# EAGLE design flashtest (EAGLE 9.3.0)
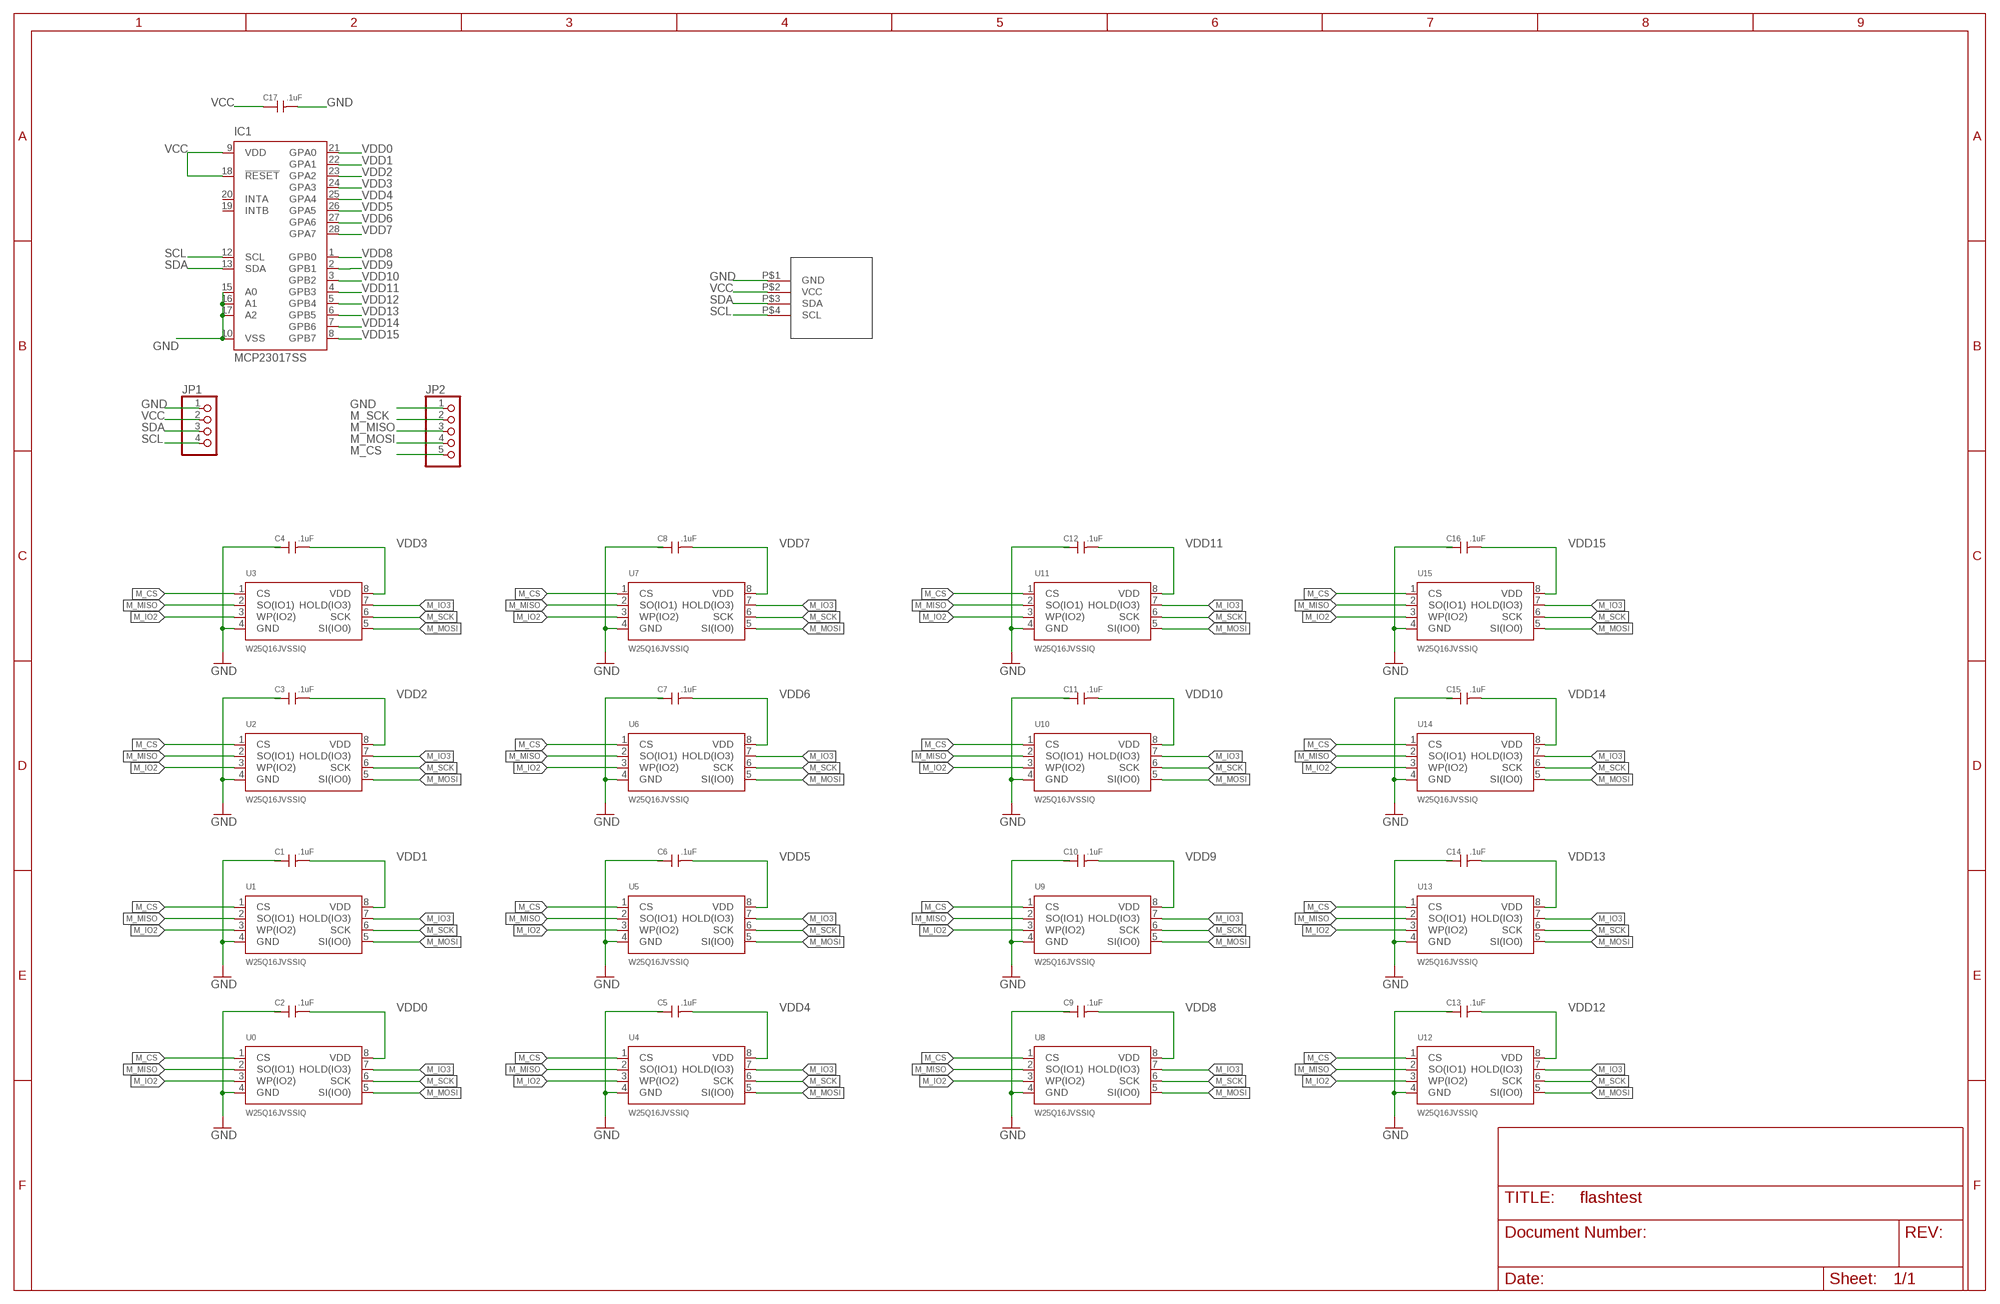
[diagram p0: schematic, sheet 1]

## Parts
C1  .1uF  006-C35*40  [0603@1]
C2  .1uF  006-C35*40  [0603@1]
C3  .1uF  006-C35*40  [0603@1]
C4  .1uF  006-C35*40  [0603@1]
C5  .1uF  006-C35*40  [0603@1]
C6  .1uF  006-C35*40  [0603@1]
C7  .1uF  006-C35*40  [0603@1]
C8  .1uF  006-C35*40  [0603@1]
C9  .1uF  006-C35*40  [0603@1]
C10  .1uF  006-C35*40  [0603@1]
C11  .1uF  006-C35*40  [0603@1]
C12  .1uF  006-C35*40  [0603@1]
C13  .1uF  006-C35*40  [0603@1]
C14  .1uF  006-C35*40  [0603@1]
C15  .1uF  006-C35*40  [0603@1]
C16  .1uF  006-C35*40  [0603@1]
C17  .1uF  006-C35*40  [0603@1]
IC1  MCP23017SS  [SSOP28]
JP1  PINHD-1X4  [1X04]
JP2  PINHD-1X5  [1X05]
U0  W25Q16JVSSIQ  FLASH_QSPI  [SOIC-8]
U1  W25Q16JVSSIQ  FLASH_QSPI  [SOIC-8]
U2  W25Q16JVSSIQ  FLASH_QSPI  [SOIC-8]
U3  W25Q16JVSSIQ  FLASH_QSPI  [SOIC-8]
U4  W25Q16JVSSIQ  FLASH_QSPI  [SOIC-8]
U5  W25Q16JVSSIQ  FLASH_QSPI  [SOIC-8]
U6  W25Q16JVSSIQ  FLASH_QSPI  [SOIC-8]
U7  W25Q16JVSSIQ  FLASH_QSPI  [SOIC-8]
U8  W25Q16JVSSIQ  FLASH_QSPI  [SOIC-8]
U9  W25Q16JVSSIQ  FLASH_QSPI  [SOIC-8]
U10  W25Q16JVSSIQ  FLASH_QSPI  [SOIC-8]
U11  W25Q16JVSSIQ  FLASH_QSPI  [SOIC-8]
U12  W25Q16JVSSIQ  FLASH_QSPI  [SOIC-8]
U13  W25Q16JVSSIQ  FLASH_QSPI  [SOIC-8]
U14  W25Q16JVSSIQ  FLASH_QSPI  [SOIC-8]
U15  W25Q16JVSSIQ  FLASH_QSPI  [SOIC-8]
U$1  I2C  [I2C]

## Nets
GND: C1.1 C2.1 C3.1 C4.1 C5.1 C6.1 C7.1 C8.1 C9.1 C10.1 C11.1 C12.1 C13.1 C14.1 C15.1 C16.1 C17.2 IC1.10(VSS) IC1.15(A0) IC1.16(A1) IC1.17(A2) JP1.1 JP2.1 U0.4(GND) U1.4(GND) U2.4(GND) U3.4(GND) U4.4(GND) U5.4(GND) U6.4(GND) U7.4(GND) U8.4(GND) U9.4(GND) U10.4(GND) U11.4(GND) U12.4(GND) U13.4(GND) U14.4(GND) U15.4(GND) U$1.P$1(GND)
M_CS: JP2.5 U0.1(CS) U1.1(CS) U2.1(CS) U3.1(CS) U4.1(CS) U5.1(CS) U6.1(CS) U7.1(CS) U8.1(CS) U9.1(CS) U10.1(CS) U11.1(CS) U12.1(CS) U13.1(CS) U14.1(CS) U15.1(CS)
M_IO2: U0.3(WP(IO2)) U1.3(WP(IO2)) U2.3(WP(IO2)) U3.3(WP(IO2)) U4.3(WP(IO2)) U5.3(WP(IO2)) U6.3(WP(IO2)) U7.3(WP(IO2)) U8.3(WP(IO2)) U9.3(WP(IO2)) U10.3(WP(IO2)) U11.3(WP(IO2)) U12.3(WP(IO2)) U13.3(WP(IO2)) U14.3(WP(IO2)) U15.3(WP(IO2))
M_IO3: U0.7(HOLD(IO3)) U1.7(HOLD(IO3)) U2.7(HOLD(IO3)) U3.7(HOLD(IO3)) U4.7(HOLD(IO3)) U5.7(HOLD(IO3)) U6.7(HOLD(IO3)) U7.7(HOLD(IO3)) U8.7(HOLD(IO3)) U9.7(HOLD(IO3)) U10.7(HOLD(IO3)) U11.7(HOLD(IO3)) U12.7(HOLD(IO3)) U13.7(HOLD(IO3)) U14.7(HOLD(IO3)) U15.7(HOLD(IO3))
M_MISO: JP2.3 U0.2(SO(IO1)) U1.2(SO(IO1)) U2.2(SO(IO1)) U3.2(SO(IO1)) U4.2(SO(IO1)) U5.2(SO(IO1)) U6.2(SO(IO1)) U7.2(SO(IO1)) U8.2(SO(IO1)) U9.2(SO(IO1)) U10.2(SO(IO1)) U11.2(SO(IO1)) U12.2(SO(IO1)) U13.2(SO(IO1)) U14.2(SO(IO1)) U15.2(SO(IO1))
M_MOSI: JP2.4 U0.5(SI(IO0)) U1.5(SI(IO0)) U2.5(SI(IO0)) U3.5(SI(IO0)) U4.5(SI(IO0)) U5.5(SI(IO0)) U6.5(SI(IO0)) U7.5(SI(IO0)) U8.5(SI(IO0)) U9.5(SI(IO0)) U10.5(SI(IO0)) U11.5(SI(IO0)) U12.5(SI(IO0)) U13.5(SI(IO0)) U14.5(SI(IO0)) U15.5(SI(IO0))
M_SCK: JP2.2 U0.6(SCK) U1.6(SCK) U2.6(SCK) U3.6(SCK) U4.6(SCK) U5.6(SCK) U6.6(SCK) U7.6(SCK) U8.6(SCK) U9.6(SCK) U10.6(SCK) U11.6(SCK) U12.6(SCK) U13.6(SCK) U14.6(SCK) U15.6(SCK)
SCL: IC1.12(SCL) JP1.4 U$1.P$4(SCL)
SDA: IC1.13(SDA) JP1.3 U$1.P$3(SDA)
VCC: C17.1 IC1.9(VDD) IC1.18(!RESET) JP1.2 U$1.P$2(VCC)
VDD0: C2.2 IC1.21(GPA0) U0.8(VDD)
VDD1: C1.2 IC1.22(GPA1) U1.8(VDD)
VDD2: C3.2 IC1.23(GPA2) U2.8(VDD)
VDD3: C4.2 IC1.24(GPA3) U3.8(VDD)
VDD4: C5.2 IC1.25(GPA4) U4.8(VDD)
VDD5: C6.2 IC1.26(GPA5) U5.8(VDD)
VDD6: C7.2 IC1.27(GPA6) U6.8(VDD)
VDD7: C8.2 IC1.28(GPA7) U7.8(VDD)
VDD8: C9.2 IC1.1(GPB0) U8.8(VDD)
VDD9: C10.2 IC1.2(GPB1) U9.8(VDD)
VDD10: C11.2 IC1.3(GPB2) U10.8(VDD)
VDD11: C12.2 IC1.4(GPB3) U11.8(VDD)
VDD12: C13.2 IC1.5(GPB4) U12.8(VDD)
VDD13: C14.2 IC1.6(GPB5) U13.8(VDD)
VDD14: C15.2 IC1.7(GPB6) U14.8(VDD)
VDD15: C16.2 IC1.8(GPB7) U15.8(VDD)
Unconnected: IC1.19(INTB) IC1.20(INTA)

## Library data of the parts
C1-C17 = Discrete:006-C*: Ceramic Capacitors
IC1 = microchip:MCP23017: http://ww1.microchip.com/downloads/en/DeviceDoc/21952a.pdf Source: http://ww1.microchip.com/downloads/en/DeviceDoc/21952a.pdf; MF: MICROCHIP; MPN: MCP23017-E/SS; OC_FARNELL: 1467674; OC_NEWARK: 31K2960
JP1 = pinhead:PINHD-1X4: PIN HEADER
JP2 = pinhead:PINHD-1X5: PIN HEADER
U0 U1-U15 = TravisT_MEM:FLASH_QSPI
U$1 = i2c:I2C

## Board
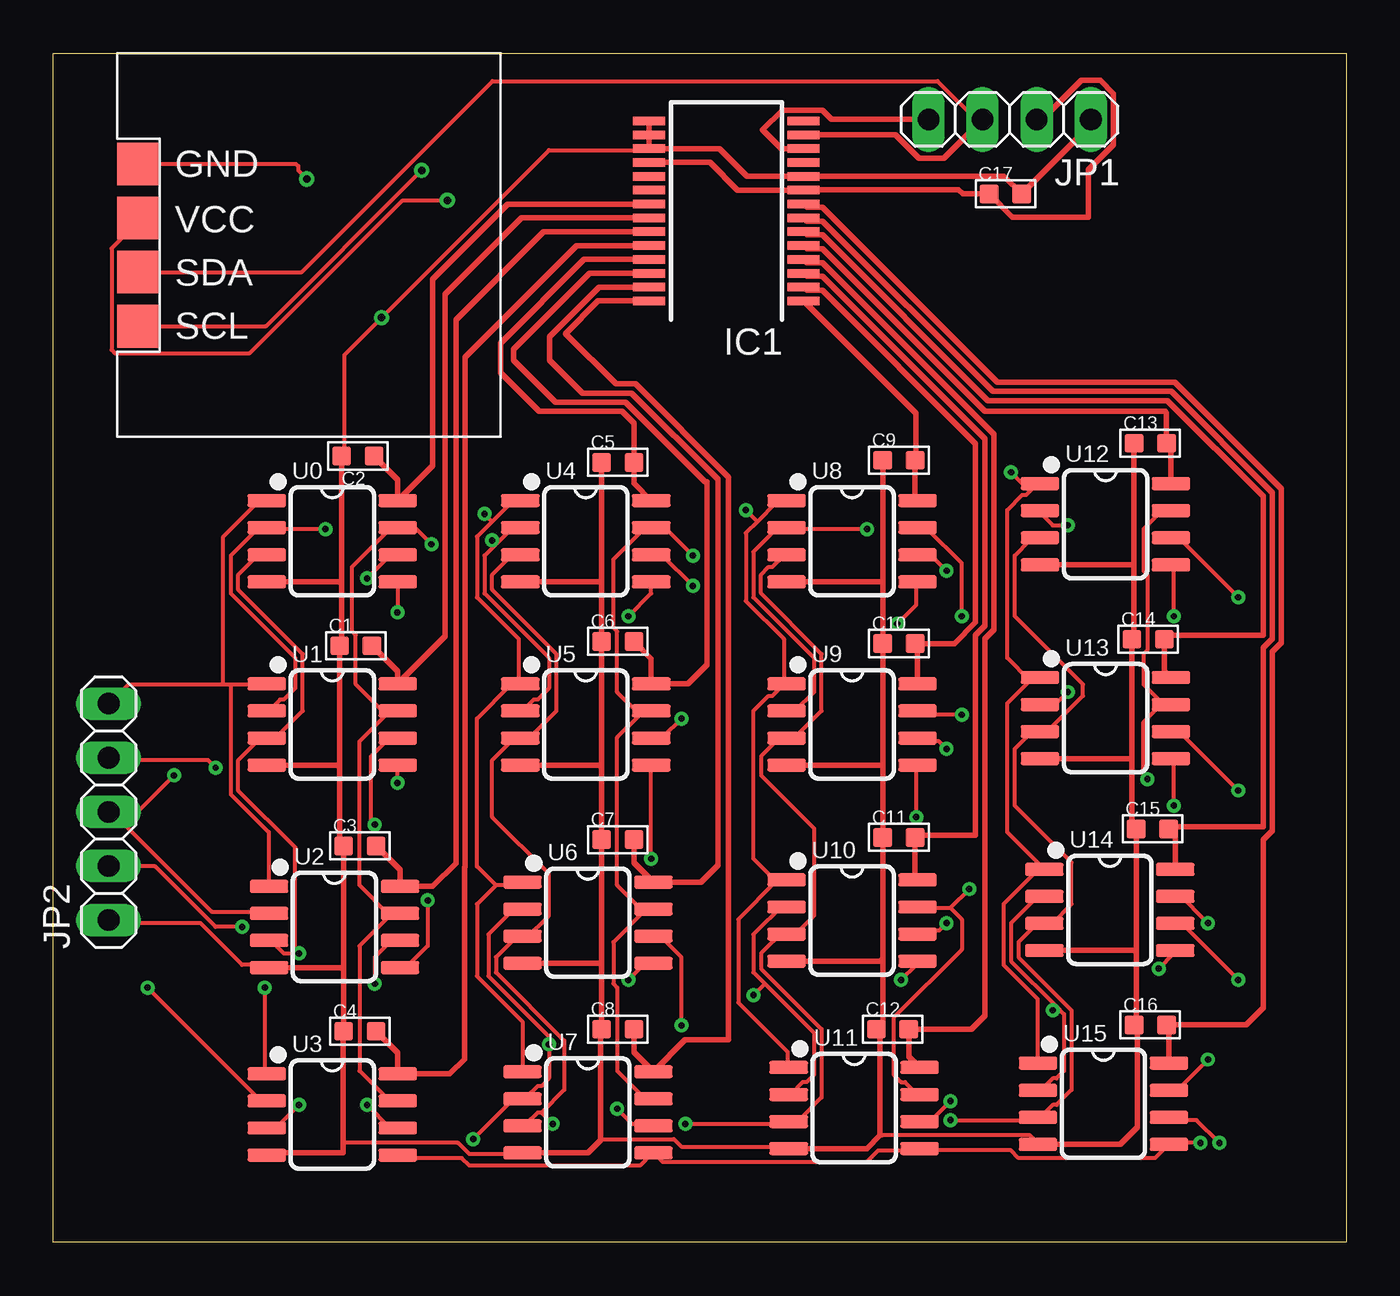
[diagram p1: board, top side]
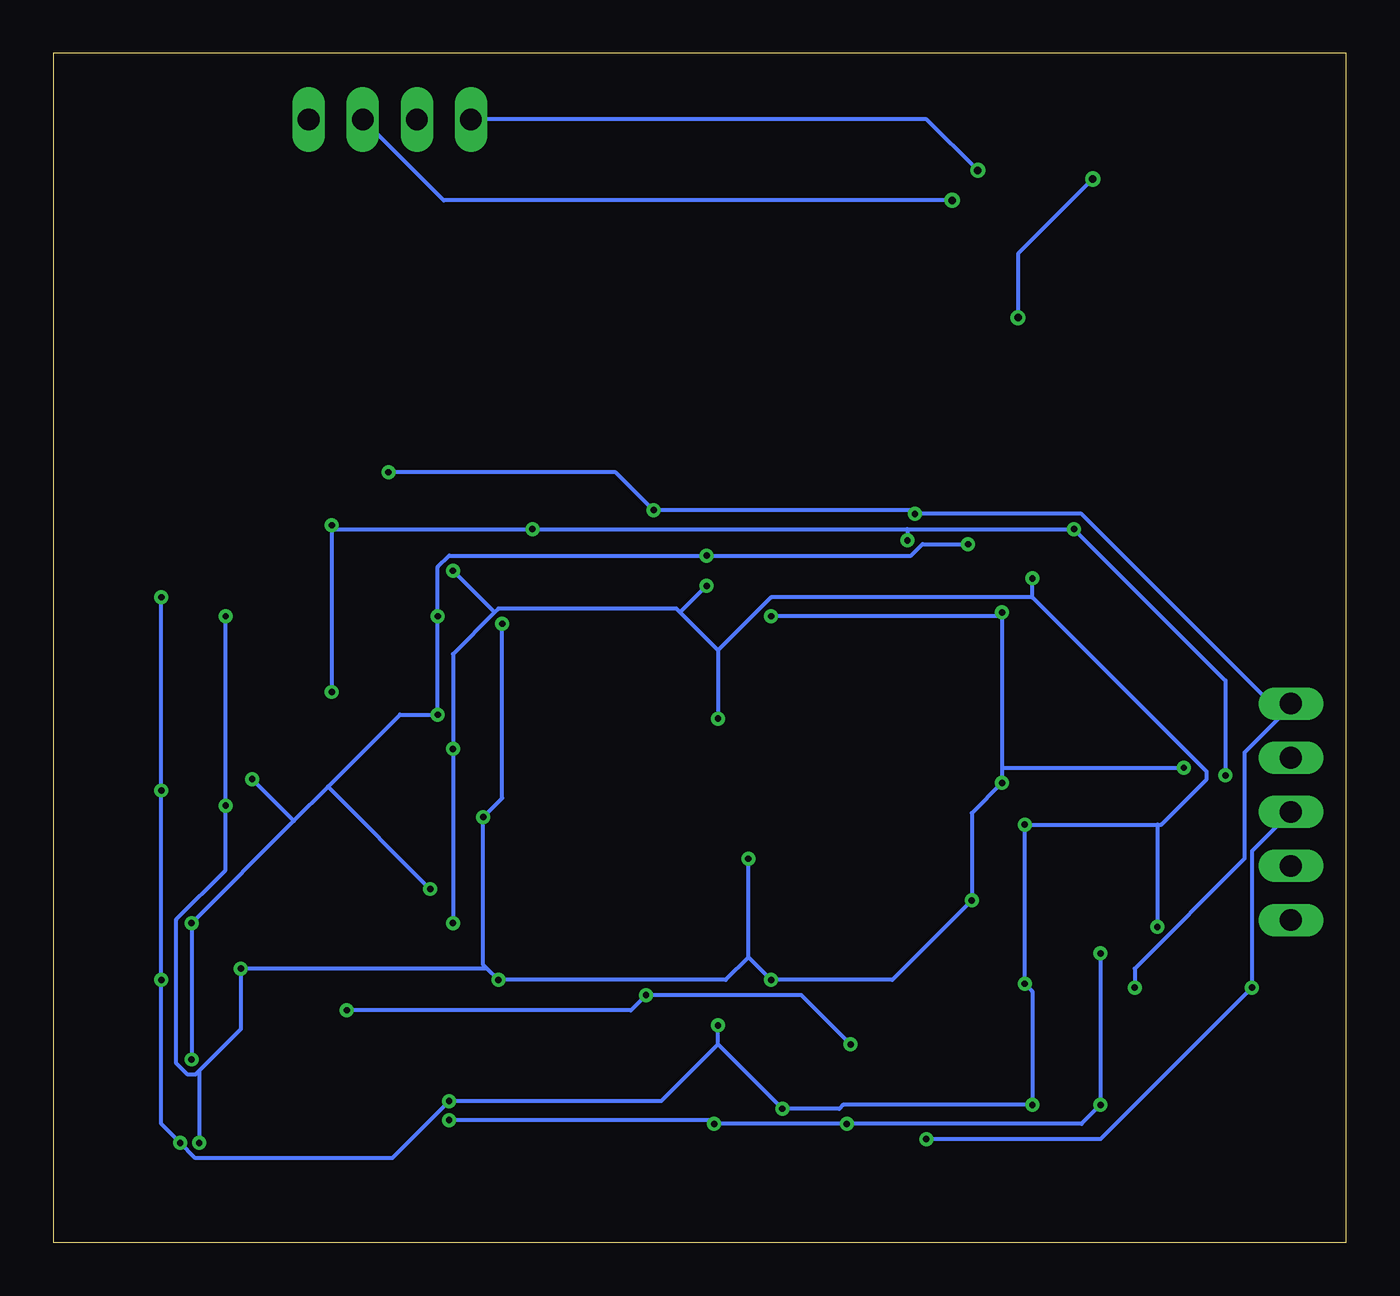
[diagram p2: board, bottom side, seen from below]

Size 60.7 x 55.8 mm. Coordinates in mm from the lower left corner, seen from the top.
Outline: 0,0 0,55.8 60.7,55.8 60.7,0 0,0
Copper layers (1*16): Top 0.0356mm / dielectric 1.5011mm / Bottom 0.0356mm
Design rules "TravisT-2_DRC *": minimum track width 7mil, minimum drill 0.3mm, track to track 7mil, track to pad 7mil, pad to pad 7mil, via to via 7mil, smd to smd 0mil, copper to edge 25mil, drill to drill 8mil, minimum pad ring 7mil, minimum via ring 7mil, stop-mask expansion 2.5mil, vias tented up to drill 16mil, thermal gap 10mil

### Footprints (pad centres in the part's own frame; a part is rotated, then mirrored left to right if it is on the bottom)
0603@1 = smd 0.889 x 0.889: 1 -0.762,0; 2 0.762,0
SSOP28 = smd 0.4 x 1.5: 1 -4.225,-3.625; 2 -3.575,-3.625; 3 -2.925,-3.625; 4 -2.275,-3.625; 5 -1.625,-3.625; 6 -0.975,-3.625; 7 -0.325,-3.625; 8 0.325,-3.625; 9 0.975,-3.625; 10 1.625,-3.625; 11 2.275,-3.625; 12 2.925,-3.625; 13 3.575,-3.625; 14 4.225,-3.625; 15 4.225,3.625; 16 3.575,3.625; 17 2.925,3.625; 18 2.275,3.625; 19 1.625,3.625; 20 0.975,3.625; 21 0.325,3.625; 22 -0.325,3.625; 23 -0.975,3.625; 24 -1.625,3.625; 25 -2.275,3.625; 26 -2.925,3.625; 27 -3.575,3.625; 28 -4.225,3.625
1X04 = drill 1.016 long: 1 -3.81,0; 2 -1.27,0; 3 1.27,0; 4 3.81,0
1X05 = drill 1.016 long: 1 -5.08,0; 2 -2.54,0; 3 0,0; 4 2.54,0; 5 5.08,0
SOIC-8 = smd 0.6 x 1.8: 1 -1.905,-3.073; 2 -0.635,-3.073; 3 0.635,-3.073; 4 1.905,-3.073; 5 1.905,3.073; 6 0.635,3.073; 7 -0.635,3.073; 8 -1.905,3.073
I2C = smd 2 x 2: P$1 -8,3.81; P$2 -8,1.27; P$3 -8,-1.27; P$4 -8,-3.81

### Placement (x,y rotation side)
C1  14.2,28 0 top
C2  14.3,36.9 0 top
C3  14.4,18.6 0 top
C4  14.4,9.9 0 top
C5  26.5,36.6 0 top
C6  26.5,28.2 0 top
C7  26.5,18.9 0 top
C8  26.5,10 0 top
C9  39.7,36.7 0 top
C10  39.7,28.1 0 top
C11  39.7,19 0 top
C12  39.4,10 0 top
C13  51.5,37.5 0 top
C14  51.4,28.3 0 top
C15  51.6,19.4 0 top
C16  51.5,10.2 0 top
C17  44.7,49.2 0 top
IC1  31.6,48.4 90 top
JP1  44.9,52.7 180 top
JP2  2.6,20.2 90 top
U0  13.1,32.9 270 top
U1  13.1,24.3 270 top
U2  13.2,14.8 270 top
U3  13.1,6 270 top
U4  25,32.9 270 top
U5  25,24.3 270 top
U6  25.1,15 270 top
U7  25.1,6.1 270 top
U8  37.5,32.9 270 top
U9  37.5,24.3 270 top
U10  37.5,15.1 270 top
U11  37.6,6.3 270 top
U12  49.4,33.7 270 top
U13  49.4,24.6 270 top
U14  49.6,15.6 270 top
U15  49.3,6.5 270 top
U$1  12,46.8 0 top

### Tracks (layer width: path | path; a pad name or v marks a point on that pad's centre or on a via)
GND  (via drill 0.35)
  Top 0.178: 38.82,5.02 38.92,5.02 45.85,5.02 46.21,4.67 U15.4 | JP2.1 2.65,14.98 6.91,14.98 8.87,13.02 10.11,13.02 U2.4 | 13.6,4.67 19,4.67 19.54,4.13 22.03,4.13 U7.4 | IC1.17 27.89,51.25 23.27,51.25 v15.41,43.39 13.67,41.65 13.67,37.03 C2.1 | U11.4 34.47,4.49 29.49,4.49 29.14,4.85 25.76,4.85 25.7,4.8 | U$1.P$1 11.39,50.61 11.5,50.5 11.5,50.3 v11.9,49.9
  Top 0.25: C2.1 13.54,30.9 | 13.54,30.9 13.54,28.1 C1.1 13.44,22.3 | 13.44,22.3 13.44,18.8 C3.1 13.64,12.8 | 13.64,12.8 C4.1 13.6,9.86 13.6,4.67 13.6,4.2 10.13,4.2 U3.4 | C5.1 25.74,31 | 25.74,31 C6.1 25.74,22.3 | 25.74,22.3 C7.1 25.74,13.2 | 25.74,13.2 C8.1 25.7,9.96 25.7,4.8 25.1,4.2 U7.4 | C9.1 38.94,30.9 | 38.94,30.9 C10.1 38.94,22.4 | 38.94,22.4 C11.1 38.94,13.3 | 38.94,13.3 38.94,10.3 38.82,10.18 | 38.82,10.18 C12.1 | C13.1 50.74,31.8 | 50.74,31.8 50.74,28.4 C14.1 50.64,22.7 | 50.64,22.7 50.64,19.6 C15.1 50.84,13.6 | 50.84,13.6 50.84,10.3 C16.1 50.9,10.04 50.9,5.4 50.09,4.6 U15.4 | U0.4 13.44,30.99 13.54,30.9 | U1.4 13.34,22.39 13.44,22.3 | U2.4 13.54,12.89 13.64,12.8 | U5.4 25.64,22.39 25.74,22.3 | U4.4 25.73,30.99 25.74,31 | U6.4 25.63,13.1 25.74,13.2 | U10.4 38.83,13.2 38.94,13.3 | U11.4 38.2,4.4 38.82,5.02 38.82,10.18 | U9.4 38.93,22.39 38.94,22.4 | U8.4 38.84,30.99 38.94,30.9 | U12.4 50.73,31.79 50.74,31.8 | U13.4 50.63,22.7 50.64,22.7 | U14.4 50.74,13.7 50.84,13.6 | JP1.1 48.71,52.45 C17.2 44.64,50.02 IC1.10 32.57,50.02 31.28,51.32 IC1.17 IC1.16 IC1.15
  Bottom 0.178: v11.9,49.9 15.41,46.39 v15.41,43.39
M_CS  (via drill 0.3)
  Top 0.178: 46.38,17.65 44.61,15.87 44.61,13.02 46.21,11.42 46.21,8.58 U15.1 | 45.85,26.36 46.21,26.36 U13.1 45.85,26.36 | 45.85,26.36 44.78,25.29 44.78,19.25 46.38,17.65 | 46.38,17.65 U14.1 | 45.85,35.25 45.67,35.07 45.49,35.07 44.78,34.36 44.78,27.43 45.85,26.36 | 45.85,35.25 46.21,35.6 U12.1 | 33.05,33.83 33.94,34.71 34.29,34.71 U8.1 | 33.05,33.83 32.52,33.29 32.52,30.09 34.29,28.31 34.29,26.36 U9.1 34.29,26.18 33.76,25.65 33.58,25.65 32.87,24.94 32.87,18 33.94,16.93 | 33.94,16.93 32.16,15.16 32.16,11.25 34.47,8.93 34.47,8.22 U11.1 | 33.94,16.93 34.29,16.93 U10.1 33.94,16.93 | 20.6,33.83 21.49,34.71 21.85,34.71 U4.1 | 20.6,33.83 19.89,33.12 19.89,30.27 21.85,28.31 21.85,26.36 U5.1 21.85,26.18 21.49,26.18 19.89,24.58 19.89,17.65 20.78,16.76 | 20.78,16.76 19.89,15.87 19.89,12.49 22.03,10.36 22.03,8.04 U7.1 | 20.78,16.76 22.03,16.76 U6.1 | v9.94,11.96 9.94,8.04 U3.1 | 7.98,26.18 3.53,26.18 2.65,25.29 JP2.5 | 7.98,26.18 8.33,26.18 | 8.33,26.18 9.94,26.18 U1.1 | 8.33,26.18 8.33,21.02 10.11,19.25 10.11,16.76 U2.1 | 7.98,26.18 7.98,33.12 9.58,34.71 9.94,34.71 U0.1 | v20.25,34.18 20.6,33.83 | v32.52,34.36 33.05,33.83 | v44.96,36.14 45.85,35.25
  Bottom 0.178: v9.94,11.96 9.94,12.85 4.78,18 4.78,22.98 3,24.76 | 3,24.76 2.65,25.11 JP2.5 3,24.76 | 3,24.76 12.42,34.18 v20.25,34.18 20.43,34.36 v32.52,34.36 34.29,36.14 v44.96,36.14
M_IO2  (via drill 0.3)
  Top 0.178: U12.3 46.21,32.94 45.85,32.94 45.14,32.23 45.14,29.38 48.34,26.18 48.34,25.65 46.74,24.05 46.38,24.05 U13.3 46.21,23.87 45.85,23.87 45.14,23.16 45.14,20.49 47.81,17.82 47.81,15.87 46.92,14.98 46.56,14.98 U14.3 46.38,14.8 46.03,14.8 45.32,14.09 45.32,13.38 47.81,10.89 47.81,7.16 47.09,6.45 46.92,6.45 46.38,5.91 U15.3 46.21,5.73 v42.12,5.73 | 22.91,6.09 22.74,6.09 22.2,5.56 U7.3 | 22.91,6.09 23.98,7.16 23.98,9.47 20.78,12.67 20.78,13.38 21.67,14.27 22.03,14.27 U6.3 22.2,14.27 23.27,15.34 23.27,17.29 20.6,19.96 20.6,22.62 21.49,23.51 21.85,23.51 U5.3 22.03,23.69 22.38,23.69 23.62,24.94 23.62,27.6 20.6,30.63 20.6,31.34 21.49,32.23 21.85,32.23 U4.3 | U8.3 34.29,32.23 33.76,31.69 33.58,31.69 33.23,31.34 33.23,30.45 36.07,27.6 36.07,24.94 34.83,23.69 34.47,23.69 U9.3 34.29,23.51 33.94,23.51 33.23,22.8 33.23,21.91 35.72,19.42 35.72,15.34 35,14.62 34.47,14.62 U10.3 34.29,14.62 33.23,13.56 33.23,12.85 36.07,10 36.07,6.8 35,5.73 34.65,5.73 U11.3 34.47,5.56 v29.67,5.56 | v11.54,6.45 10.47,5.38 10.11,5.38 U3.3 | 11.36,13.56 10.82,13.56 10.29,14.09 U2.3 | 11.36,13.56 11.36,18.54 8.69,21.2 8.69,22.62 9.58,23.51 9.94,23.51 U1.3 10.11,23.69 10.47,23.69 11.71,24.94 11.71,27.6 8.69,30.63 8.69,31.34 9.58,32.23 9.94,32.23 U0.3 | 11.36,13.56 v11.54,13.56 | v23.45,5.56 22.91,6.09
  Bottom 0.178: v11.54,13.56 v11.54,6.45 12.42,5.56 v23.45,5.56 v29.67,5.56 29.85,5.73 v42.12,5.73
M_IO3  (via drill 0.3)
  Top 0.178: 15.8,15.34 14.38,13.91 14.38,8.04 15.62,6.8 16.16,6.8 U3.7 | 15.8,15.34 16.16,15.34 U2.7 15.8,15.34 | 15.62,24.76 16.16,24.76 U1.7 15.62,24.76 | 15.62,24.76 14.38,23.51 14.38,16.76 15.8,15.34 | 15.62,24.76 14.2,26.18 14.2,28.49 14.02,28.67 14.02,31.69 15.8,33.47 16.16,33.47 U0.7 16.34,33.47 17.05,33.47 v17.76,32.76 | 27.71,15.51 26.29,14.09 26.29,12.13 26.47,11.96 26.47,8.04 27.71,6.8 28.07,6.8 U7.7 | 27.71,15.51 28.07,15.51 U6.7 27.71,15.51 | 27.54,24.76 28.07,24.76 U5.7 27.54,24.76 | 27.54,24.76 26.47,23.69 26.47,16.76 27.71,15.51 | 27.54,24.76 26.47,25.82 26.47,28.67 26.29,28.85 26.29,32.05 27.71,33.47 28.07,33.47 U4.7 28.25,33.47 28.78,33.47 v30.03,32.23 | 42.12,15.69 42.65,15.16 42.65,13.74 39.45,10.54 39.45,7.87 39.8,7.51 39.98,7.51 40.52,6.98 U11.7 | 42.12,15.69 40.69,15.69 U10.7 | 52.07,25.29 52.43,25.29 U13.7 52.07,25.29 | 52.07,25.29 51.18,26.18 51.18,27.6 51.36,27.78 51.36,31.34 51.18,31.51 51.18,33.47 51.89,34.18 52.43,34.18 U12.7 | v54.21,8.58 52.78,7.16 52.43,7.16 U15.7 | v54.21,14.98 52.78,16.4 U14.7 | v42.65,24.76 40.69,24.76 U9.7 | v42.65,29.38 42.65,31.87 41.05,33.47 40.69,33.47 U8.7 | 52.07,25.29 51.18,24.4 51.18,21.91 v51.36,21.74 | v43,16.58 42.12,15.69
  Bottom 0.178: v54.21,8.58 v54.21,14.98 49.41,19.78 | 49.41,19.78 47.81,21.38 | 47.81,21.38 44.43,24.76 v42.65,24.76 v42.65,29.38 42.65,31.69 42.12,32.23 v30.03,32.23 20.43,32.23 19.89,32.76 v17.76,32.76 | 49.41,19.78 v51.36,21.74 | 47.81,21.38 v43,16.58
M_MISO  (via drill 0.3)
  Top 0.178: 47.09,11.07 44.96,13.2 44.96,14.98 46.38,16.4 U14.2 | 47.09,11.07 47.45,10.71 47.45,8.04 47.09,7.69 46.92,7.69 46.38,7.16 U15.2 | 33.4,12.13 32.87,12.67 32.87,14.45 34.29,15.87 U10.2 | 33.4,12.13 35.72,9.82 35.72,7.87 35.36,7.51 35.18,7.51 34.65,6.98 U11.2 | U6.2 22.03,15.51 21.49,15.51 20.43,14.45 20.43,12.49 23.27,9.65 v23.27,9.29 23.27,7.69 22.91,7.33 22.74,7.33 22.2,6.8 U7.2 22.03,6.62 21.49,6.62 v19.71,4.85 | v32.87,11.6 33.4,12.13 | v46.92,10.89 47.09,11.07 | v4.42,11.96 9.58,6.8 9.94,6.8 U3.2 | 3.36,19.6 2.65,20.31 JP2.3 3.36,19.6 | 3.36,19.6 7.44,15.51 10.11,15.51 U2.2 | 20.78,32.76 21.49,33.47 21.85,33.47 U4.2 | 20.78,32.76 20.25,32.23 20.25,30.45 23.27,27.43 23.27,26 22.74,25.47 22.56,25.47 22.03,24.94 U5.2 | U1.2 10.11,24.94 10.65,25.47 10.82,25.47 11.36,26 11.36,27.43 8.33,30.45 8.33,32.23 9.58,33.47 9.94,33.47 U0.2 10.11,33.47 v12.78,33.47 | U9.2 34.47,24.94 34.83,24.94 35.72,25.82 35.72,27.43 32.87,30.27 32.87,32.4 33.94,33.47 34.29,33.47 U8.2 34.47,33.47 v38.2,33.47 | v47.63,25.82 47.09,25.29 46.38,25.29 U13.2 | v47.63,33.65 46.92,33.65 46.38,34.18 U12.2 | v20.6,32.94 20.78,32.76 | v5.67,21.91 3.36,19.6
  Bottom 0.178: v23.27,9.29 25.58,11.6 v32.87,11.6 33.58,10.89 v46.92,10.89 | JP2.3 2.65,20.14 4.42,18.36 v4.42,11.96 11.54,4.85 v19.71,4.85 | 47.63,33.47 v47.63,25.82 | 47.63,33.47 v38.2,33.47 20.6,33.47 | 47.63,33.47 v47.63,33.65 | 20.6,33.47 v12.78,33.47 5.67,26.36 v5.67,21.91 | 20.6,33.47 v20.6,32.94
M_MOSI  (via drill 0.3)
  Top 0.178: U3.5 16.34,3.96 19.18,3.96 19.54,3.6 27.54,3.6 28.07,4.13 U7.5 28.25,4.13 28.6,3.78 38.2,3.78 38.74,4.31 40.52,4.31 U11.5 40.69,4.31 44.96,4.31 45.32,3.96 51.72,3.96 52.25,4.49 U15.5 52.43,4.67 v53.85,4.67 | v16.16,21.56 16.16,22.27 U1.5 | v16.16,29.56 16.16,30.98 U0.5 | v17.58,16.05 17.58,13.91 16.69,13.02 16.34,13.02 U2.5 | v27,12.31 27.71,13.02 28.07,13.02 U6.5 | v28.07,18 28.07,22.27 U5.5 | v39.8,12.31 40.52,13.02 U10.5 | v27,29.38 28.07,30.45 U4.5 | v40.52,19.96 40.52,22.27 U9.5 | v51.89,12.85 52.61,13.56 U14.5 | v52.61,20.49 52.61,22.62 U13.5 | v39.63,29.03 40.52,29.91 40.52,30.98 U8.5 | v52.61,29.38 52.61,31.69 U12.5 | v7.62,22.27 7.27,22.62 2.65,22.62 JP2.4
  Bottom 0.178: 16.16,29.38 16.16,22.27 | 16.16,22.27 v16.16,21.56 17.58,20.14 v17.58,16.05 21.31,12.31 v27,12.31 28.07,13.38 | 28.07,13.38 v28.07,18 | 28.07,13.38 29.14,12.31 v39.8,12.31 40.34,12.85 | 16.16,29.38 v27,29.38 | 16.16,29.38 v16.16,29.56 | 40.34,12.85 40.52,13.02 v40.52,19.96 39.63,20.85 v39.63,29.03 | 40.34,12.85 v51.89,12.85 51.89,10 53.85,8.04 | 53.85,8.04 54.03,7.87 54.38,7.87 54.92,8.4 54.92,15.16 52.61,17.47 v52.61,20.49 v52.61,29.38 | 16.16,22.27 v7.62,22.27 | 53.85,8.04 v53.85,4.67
M_SCK  (via drill 0.3)
  Top 0.178: v14.74,6.45 15.8,5.38 16.16,5.38 U3.6 | v15.09,12.13 15.09,13.38 15.8,14.09 16.16,14.09 U2.6 | v26.47,6.27 27.18,5.56 28.07,5.56 U7.6 | v15.09,19.6 14.91,19.78 14.91,22.8 15.62,23.51 16.16,23.51 U1.6 | v29.49,10.18 29.49,13.38 28.6,14.27 28.25,14.27 U6.6 | v42.12,6.62 41.23,5.73 40.69,5.73 U11.6 | v14.74,31.16 15.8,32.23 16.16,32.23 U0.6 | v29.49,24.58 28.6,23.69 28.25,23.69 U5.6 | v41.94,14.98 41.58,14.62 40.69,14.62 U10.6 | v54.74,4.67 53.67,5.73 52.43,5.73 U15.6 | v30.03,30.8 28.6,32.23 28.25,32.23 U4.6 | v55.63,12.31 53.14,14.8 52.78,14.8 U14.6 | v41.94,23.16 41.58,23.51 40.69,23.51 U9.6 | v41.94,31.51 41.23,32.23 40.69,32.23 U8.6 | v55.63,21.2 52.96,23.87 52.61,23.87 U13.6 | v55.63,30.27 52.96,32.94 52.61,32.94 U12.6 | v8.87,14.8 7.62,14.8 4.78,17.65 2.65,17.65 JP2.2
  Bottom 0.178: 29.49,9.29 v29.49,10.18 | 29.49,9.29 v26.47,6.27 23.8,6.27 23.62,6.45 v14.74,6.45 14.74,11.78 v15.09,12.13 v15.09,19.6 8.87,19.6 | 29.49,9.29 32.16,6.62 v42.12,6.62 44.78,3.96 54.03,3.96 v54.74,4.67 55.63,5.56 v55.63,12.31 v55.63,21.2 v55.63,30.27 | 14.74,30.27 v14.74,31.16 | 14.74,30.27 6.56,22.09 6.56,21.74 8.69,19.6 8.87,19.6 | 29.49,27.78 v29.49,24.58 | 29.49,27.78 27,30.27 14.74,30.27 | v41.94,14.98 v41.94,23.16 41.94,27.6 39.98,29.56 | 39.98,29.56 39.8,29.74 31.45,29.74 31.27,29.56 | 29.49,27.78 31.27,29.56 | 31.27,29.56 v30.03,30.8 | 39.98,29.56 v41.94,31.51 | 8.87,19.6 v8.87,14.8
SCL  (via drill 0.35)
  Top 0.178: U$1.P$4 9.99,42.99 v17.3,50.3
  Top 0.25: JP1.4 36.53,52.7 36.1,53.13 34.23,53.13 33.3,52.2 34.17,51.32 IC1.12
  Bottom 0.178: v17.3,50.3 19.7,52.7 JP1.4
SDA
  Top 0.178: U$1.P$3 11.65,45.53 20.62,54.49 41.52,54.49 43.42,52.59 43.52,52.59
  Top 0.25: IC1.13 39.55,51.98 40.65,50.87 41.8,50.87 43.52,52.59 JP1.3
VCC  (via drill 0.35)
  Top 0.178: U$1.P$2 4.83,48.9 4.83,48.74 2.73,46.64 2.73,41.88 2.89,41.72 9.23,41.72 16.4,48.9 v18.5,48.9
  Top 0.25: JP1.2 46.44,52.7 48.27,54.53 49.15,54.53 49.77,53.9 49.77,51.5 48.6,50.32 48.6,48.1 45.04,48.1 C17.1 42.7,49.2 42.5,49.4 35.25,49.4 IC1.9 32.12,49.38 30.82,50.67 IC1.18
  Bottom 0.178: v18.5,48.9 42.37,48.9 JP1.2
VDD0
  Top 0.25: IC1.21 21.32,48.73 17.8,45.2 17.8,36.43 U0.8 16.17,35.79 C2.2
VDD1
  Top 0.25: IC1.22 21.98,48.07 18.4,44.5 18.4,28.43 U1.8 16.17,26.79 C1.2
VDD2
  Top 0.25: IC1.23 23.03,47.42 18.9,43.3 18.9,17.8 17.8,16.7 U2.8 16.27,17.49 C3.2
VDD3
  Top 0.25: IC1.24 24.57,46.77 19.33,41.53 19.33,17.62 19.3,17.59 19.3,8.6 18.61,7.91 U3.8 16.17,8.89 C4.2
VDD4
  Top 0.25: IC1.25 24.93,46.12 21,42.2 21,40.8 22.8,39 26.7,39 27.26,38.44 C5.2 27.26,35.62 U4.8
VDD5
  Top 0.25: IC1.26 25.18,45.48 21.6,41.9 21.6,41.4 23.57,39.43 26.88,39.43 30.61,35.7 30.7,35.7 30.7,27.1 29.8,26.2 U5.8 28.07,27.39 C6.2
VDD6
  Top 0.25: IC1.27 25.62,44.82 23.3,42.5 23.3,41.4 24.84,39.86 27.15,39.86 31.2,35.8 31.2,17.7 30.41,16.9 U6.8 27.26,17.82 C7.2
VDD7
  Top 0.25: IC1.28 25.58,44.17 24.05,42.65 26.42,40.28 27.33,40.28 31.7,35.91 31.7,9.5 29.67,9.5 U7.8 27.26,8.92 C8.2
VDD8
  Top 0.25: IC1.1 40.5,38.9 40.5,36.74 C9.2 40.46,34.92 U8.8
VDD9
  Top 0.25: IC1.2 35.37,44.68 36.1,44.68 43.3,37.48 43.3,29.1 42.3,28.1 C10.2 40.57,27.99 U9.8
VDD10
  Top 0.25: IC1.3 35.37,45.33 36.1,45.33 43.73,37.7 43.73,28.92 43.3,28.49 43.3,19.1 40.56,19.1 C11.2 40.46,17.12 U10.8
VDD11
  Top 0.25: IC1.4 35.37,45.98 36.1,45.98 44.16,37.92 44.16,28.75 43.73,28.32 43.73,10.63 43.1,10 C12.2 40.16,8.72 U11.8
VDD12
  Top 0.25: IC1.5 35.37,46.63 36.1,46.63 43.73,39 52.2,39 52.26,38.94 C13.2 52.47,37.29 U12.8
VDD13
  Top 0.25: IC1.6 35.37,47.28 36.1,47.28 43.88,39.5 52.3,39.5 56.8,35 56.8,28.5 52.36,28.5 C14.2 52.16,26.82 U13.8
VDD14
  Top 0.25: IC1.7 35.37,47.93 36.1,47.93 44.1,39.93 52.48,39.93 57.23,35.18 57.23,28.32 56.8,27.89 56.8,19.5 52.46,19.5 C15.2 52.67,19.09 U14.8
VDD15
  Top 0.25: IC1.8 35.37,48.58 36.1,48.58 44.32,40.36 52.66,40.36 57.66,35.36 57.66,28.15 57.23,27.72 57.23,19.32 56.8,18.89 56.8,11 56,10.2 C16.2 52.37,10.09 U15.8